# Altium schematic sheet ethernet_RJ45.SchDoc
size A4; SheetNumber: 2; SheetTotal: 5
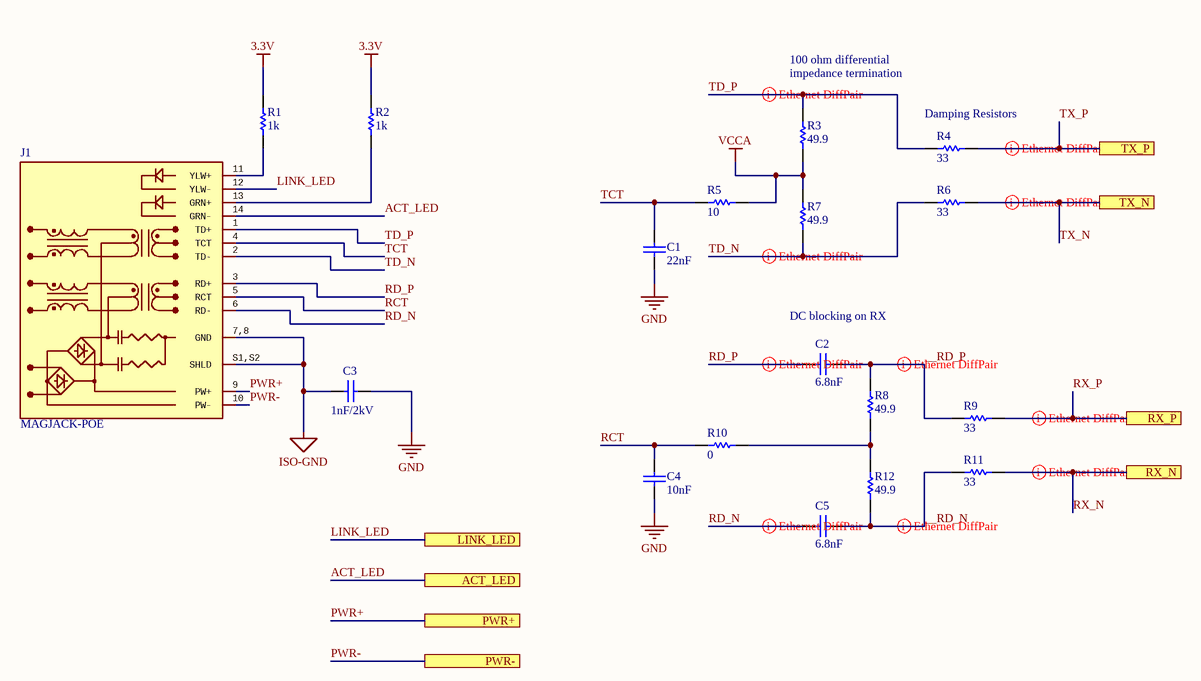
[diagram p0: ethernet_RJ45.SchDoc]

## Parts
C1  value 22nF  [0603 - Capacitor]  (hidden comment: Capacitor - Nonpolarized)
C2  value 6.8nF  [0603 - Capacitor]  (hidden comment: Capacitor - Nonpolarized)
C3  value 1nF/2kV  [1206 - Capacitor]  (hidden comment: Capacitor - Nonpolarized)
C4  value 10nF  [0603 - Capacitor]  (hidden comment: Capacitor - Nonpolarized)
C5  value 6.8nF  [0603 - Capacitor]  (hidden comment: Capacitor - Nonpolarized)
J1  MAGJACK-POE  [ARJP11A-MASA-B-A-EMU2]
R1  value 1k  [0603 - Resistor]  (hidden comment: Resistor)
R2  value 1k  [0603 - Resistor]  (hidden comment: Resistor)
R3  value 49.9  [0603 - Resistor]  (hidden comment: Resistor)
R4  value 33  [0603 - Resistor]  (hidden comment: Resistor)
R5  value 10  [0603 - Resistor]  (hidden comment: Resistor)
R6  value 33  [0603 - Resistor]  (hidden comment: Resistor)
R7  value 49.9  [0603 - Resistor]  (hidden comment: Resistor)
R8  value 49.9  [0603 - Resistor]  (hidden comment: Resistor)
R9  value 33  [0603 - Resistor]  (hidden comment: Resistor)
R10  value 0  [0603 - Resistor]  (hidden comment: Resistor)
R11  value 33  [0603 - Resistor]  (hidden comment: Resistor)
R12  value 49.9  [0603 - Resistor]  (hidden comment: Resistor)

## Ports
ACT_LED (see main[2B]), LINK_LED (see main[2B]), PWR+ (see main[2B]), PWR- (see main[2B]), RX_N (see main[2B]), RX_P (see main[2B]), TX_N (see main[2B]), TX_P (see main[2B])

## Nets
3.3V: R1.2 R2.2
GND: C1.1 C3.1 C4.1
ISO-GND: C3.2 J1.7,8(GND) J1.S1,S2(SHLD)
VCCA: R3.1 R5.1 R7.2
__RD_N: C5.1 R11.2 R12.1
__RD_P: C2.1 R8.2 R9.2
ACT_LED: J1.14(GRN-) ; port ACT_LED
LINK_LED: J1.12(YLW-) ; port LINK_LED
PWR+: J1.9(PW+) ; port PWR+
PWR-: J1.10(PW-) ; port PWR-
RCT: C4.2 J1.5(RCT) R10.2
RD_N: C5.2 J1.6(RD-)
RD_P: C2.2 J1.3(RD+)
RX_N: R11.1 ; port RX_N
RX_P: R9.1 ; port RX_P
TCT: C1.2 J1.4(TCT) R5.2
TD_N: J1.2(TD-) R6.2 R7.1
TD_P: J1.1(TD+) R3.2 R4.2
TX_N: R6.1 ; port TX_N
TX_P: R4.1 ; port TX_P
NetJ1_11: J1.11(YLW+) R1.1
NetJ1_13: J1.13(GRN+) R2.1
NetR8_1: R8.1 R10.1 R12.2

## Layout directives
differential pair; differential pair class Ethernet: __RD_N, __RD_P, RD_N, RD_P, RX_N, RX_P, TD_N, TD_P, TX_N, TX_P

## Notes on the sheet
- 100 ohm differential
- (near R3) impedance termination
- (near R4) Damping Resistors
- (near C2) DC blocking on RX

## Library data of the parts
C1 = Capacitor - Nonpolarized: Nonpolarized Capacitor; Manufacturer: Samsung Electro-Mechanics; Manufacturer Part Number: CL10B223KB8NNNC; Rating: 50V X7R +/-10%; Supplier Part Number: C21122; Supplier: JLCPCB; Link: https://jlcpcb.com/parts/componentSearch?searchTxt=C21122
C2 C5 = Capacitor - Nonpolarized: Nonpolarized Capacitor; Manufacturer: FH (Guangdong Fenghua Advanced Tech); Manufacturer Part Number: 0603B682K500NT; Rating: 50V X7R +/-10%; Supplier Part Number: C1631; Supplier: JLCPCB; Link: https://jlcpcb.com/partdetail/1983-0603B682K500NT/C1631
C3 = Capacitor - Nonpolarized: Nonpolarized Capacitor; Manufacturer: FH (Guangdong Fenghua Advanced Tech); Manufacturer Part Number: 1206B102K202NT; Rating: 2kV; Supplier Part Number: C9196; Supplier: JLCPCB; Link: https://jlcpcb.com/partdetail/9721-1206B102K202NT/C9196
C4 = Capacitor - Nonpolarized: Nonpolarized Capacitor; Manufacturer: FH (Guangdong Fenghua Advanced Tech); Manufacturer Part Number: 0603B103K500NT; Rating: 50V X7R +/-10%; Supplier Part Number: C57112; Supplier: JLCPCB; Link: https://jlcpcb.com/partdetail/58143-0603B103K500NT/C57112
J1 = ARJP11A-MASA-B-A-EMU2: pin to pad: 7,8>7+8 S1,S2>S1+S2; Manufacturer: ABRACON; Link: https://www.mouser.ca/ProductDetail/ABRACON/ARJP11A-MASA-B-A-EMU2?qs=Hi7jo9HHk1p0O4X8NyvNug%3D%3D; Manufacturer Part Number: ARJP11A-MASA-B-A-EMU2; Supplier: Mouser; Supplier Part Number: 815-RJP11AMASABAEMU2
R1 R2 = Resistor: Manufacturer Part Number: 0603WAF1001T5E; Manufacturer: UNI-ROYAL(Uniroyal Elec); Rating: 100mW; Supplier Part Number: C21190; Supplier: JLCPCB; Link: https://jlcpcb.com/partdetail/21904-0603WAF1001T5E/C21190
R3 R7 R8 R12 = Resistor: Manufacturer Part Number: 0603WAF499JT5E; Manufacturer: UNI-ROYAL(Uniroyal Elec); Rating: 100mW; Supplier Part Number: C23185; Supplier: JLCPCB; Link: https://jlcpcb.com/partdetail/23912-0603WAF499JT5E/C23185
R4 R6 R9 R11 = Resistor: Manufacturer Part Number: 0603WAF330JT5E; Manufacturer: UNI-ROYAL(Uniroyal Elec); Rating: 100mW; Supplier Part Number: C23140; Supplier: JLCPCB; Link: https://jlcpcb.com/partdetail/23867-0603WAF330JT5E/C23140
R5 = Resistor: Manufacturer Part Number: 0603WAF100JT5E; Manufacturer: UNI-ROYAL(Uniroyal Elec); Rating: 100mW; Supplier Part Number: C22859; Supplier: JLCPCB; Link: https://jlcpcb.com/partdetail/23586-0603WAF100JT5E/C22859
R10 = Resistor: Manufacturer Part Number: 0603WAF0000T5E; Manufacturer: UNI-ROYAL(Uniroyal Elec); Rating: 100mW; Supplier Part Number: C21189; Supplier: JLCPCB; Link: https://jlcpcb.com/partdetail/21903-0603WAF0000T5E/C21189